# Altium schematic sheet BopITSCH.SchDoc
size A; SheetNumber: 1; SheetTotal: 1
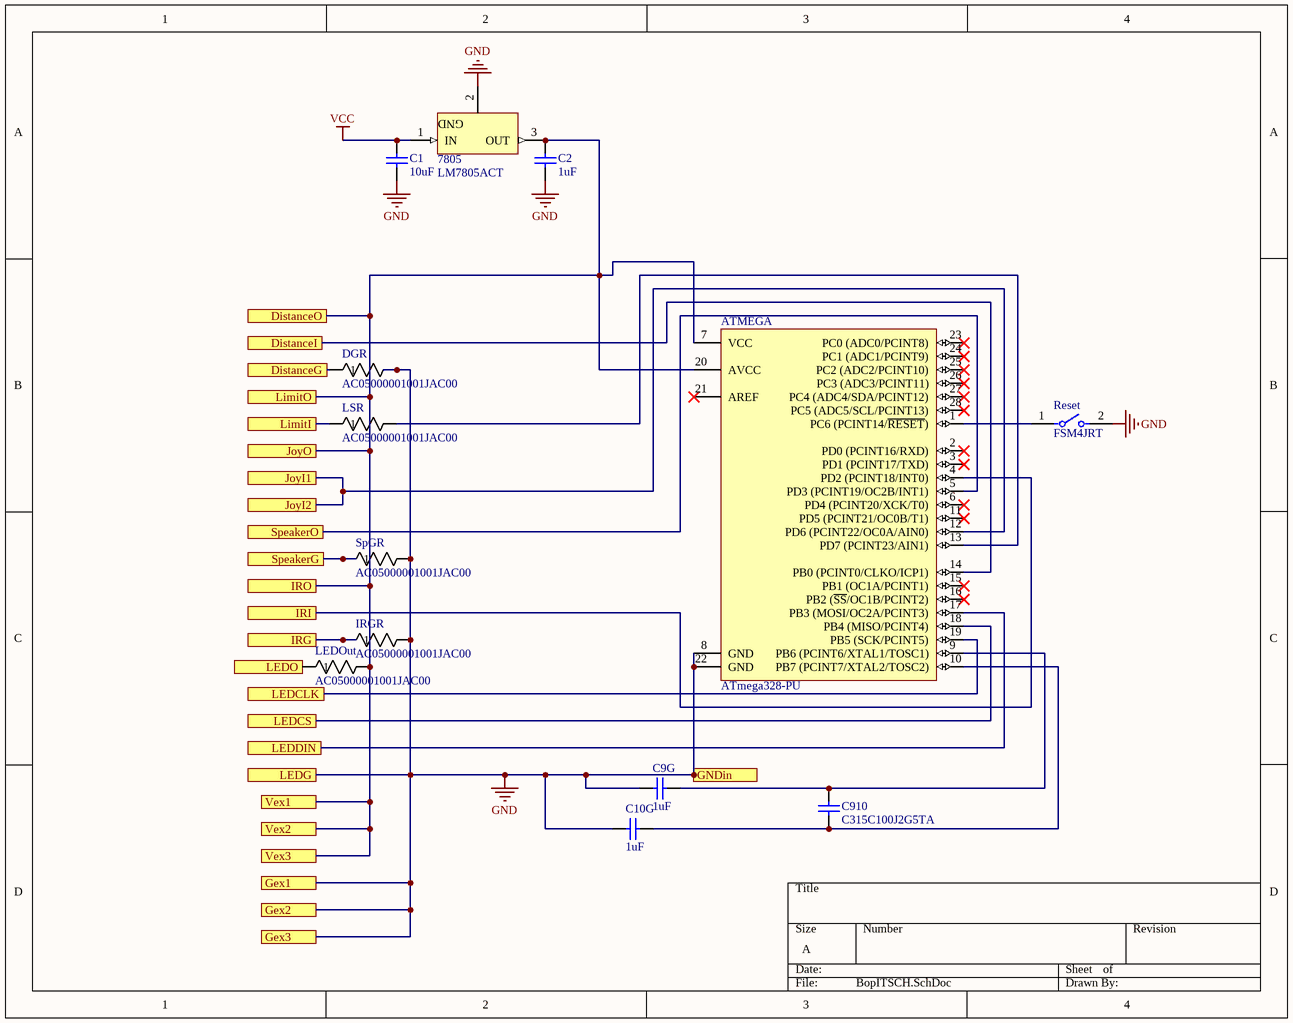
[diagram p0: BopITSCH.SchDoc]

## Parts
7805  LM7805ACT  [FAIR-TO-220-3]
ATMEGA  ATmega328-PU  [28P3]
C1  10uF  [KEMT-C315-THT-2]
C2  1uF  [KEMT-C315-THT-2]
C9G  1uF  [KEMT-C315-THT-2]
C10G  1uF  [KEMT-C315-THT-2]
C910  C315C100J2G5TA  [KEMT-C315-THT-2]
DGR  AC05000001001JAC00  [RES_AC05_VIS]
IRGR  AC05000001001JAC00  [RES_AC05_VIS]
LEDOut  AC05000001001JAC00  [RES_AC05_VIS]
LSR  AC05000001001JAC00  [RES_AC05_VIS]
Reset  FSM4JRT  [FP-FSM4JRT-MFG]
SpGR  AC05000001001JAC00  [RES_AC05_VIS]

## Ports
DistanceG, DistanceI, DistanceO, Gex1, Gex2, Gex3, GNDin, IRG, IRI, IRO, JoyI1, JoyI2, JoyO, LEDCLK, LEDCS, LEDDIN, LEDG, LEDO, LimitI, LimitO, SpeakerG, SpeakerO, Vex1, Vex2, Vex3

## Nets
GND: 7805.2(GND) ATMEGA.8(GND) ATMEGA.22(GND) C1.1 C2.1 C9G.2 C10G.2 DGR.2 IRGR.2 Reset.2 SpGR.2 ; port LEDG, port GNDin, port Gex1, port Gex2, port Gex3
VCC: 7805.1(IN) C1.2
DistanceG: DGR.1 ; port DistanceG
DistanceI: ATMEGA.14(PB0_(PCINT0/CLKO/ICP1)) ; port DistanceI
DistanceO: 7805.3(OUT) ATMEGA.7(VCC) ATMEGA.20(AVCC) C2.2 LEDOut.2 ; port DistanceO, port LimitO, port JoyO, port IRO, port Vex1, port Vex2, port Vex3
IRG: IRGR.1 ; port IRG
IRI: ATMEGA.4(PD2_(PCINT18/INT0)) ; port IRI
JoyI1: ATMEGA.12(PD6_(PCINT22/OC0A/AIN0)) ; port JoyI1, port JoyI2
LEDCLK: ATMEGA.19(PB5_(SCK/PCINT5)) ; port LEDCLK
LEDCS: ATMEGA.18(PB4_(MISO/PCINT4)) ; port LEDCS
LEDDIN: ATMEGA.17(PB3_(MOSI/OC2A/PCINT3)) ; port LEDDIN
LEDO: LEDOut.1 ; port LEDO
LimitI: LSR.1 ; port LimitI
SpeakerG: SpGR.1 ; port SpeakerG
SpeakerO: ATMEGA.5(PD3_(PCINT19/OC2B/INT1)) ; port SpeakerO
NetATMEGA_1: ATMEGA.1(PC6_(PCINT14/~{RESET})) Reset.1
NetATMEGA_9: ATMEGA.9(PB6_(PCINT6/XTAL1/TOSC1)) C9G.1 C910.2
NetATMEGA_10: ATMEGA.10(PB7_(PCINT7/XTAL2/TOSC2)) C10G.1 C910.1
NetATMEGA_13: ATMEGA.13(PD7_(PCINT23/AIN1)) LSR.2

Not connected (* = marked no-connect by the designer): ATMEGA 2(PD0_(PCINT16/RXD))* 3(PD1_(PCINT17/TXD))* 6(PD4_(PCINT20/XCK/T0))* 11(PD5_(PCINT21/OC0B/T1))* 15(PB1_(OC1A/PCINT1))* 16(PB2_(~{SS}/OC1B/PCINT2))* 21(AREF)* 23(PC0_(ADC0/PCINT8))* 24(PC1_(ADC1/PCINT9))* 25(PC2_(ADC2/PCINT10))* 26(PC3_(ADC3/PCINT11))* 27(PC4_(ADC4/SDA/PCINT12))* 28(PC5_(ADC5/SCL/PCINT13))*

## Library data of the parts
7805 = CMP-2000-04937-1: Positive Voltage Regulator, 5 V, 1 A, 0 to 125 degC, 3-Pin TO-220, RoHS, Tube; Manufacturer: Fairchild; Number of Outputs: 1; Typical Dropout Voltage @ Current: 2V@1A; Output Type: Fixed; Output Voltage: 5V; Quiescent Current: 6mA; Dropout Voltage Measurement Current: 1A; Line Regulation: 50mV; Maximum Input Voltage: 35V; Regulator Function: Linear; Load Regulation: 100mV; Package Type: TO-220; Mounting Type: ThroughHole; Height: 16.51mm; Maximum Operating Temperature: +125degC; Datasheet Version: Rev. 1.0.1, 05/2006; Package Reference: TO-220; Minimum Operating Temperature: 0degC; Manufacturer URL: https://www.fairchildsemi.com/; Package URL: https://www.fairchildsemi.com/package-drawings/TO/TO220B03.pdf; Length: 10.67mm; Series: LM78xx; Dimensions: 10.67x4.83x16.51mm; Polarity: Positive; Maximum Output Current: 1A; Pin Count: 3; Width: 4.83mm; Package Description: 3-Pin Through Hole Device, Body 10 x 4.5 mm, Pitch 2.54 mm; Datasheet URL: https://datasheet.ciiva.com/5816/1359194-5816420.pdf
ATMEGA = CMP-0095-00015-2: 8-bit AVR Microcontroller, 32KB Flash, 1KB EEPROM, 2KB SRAM, 28-pin PDIP, Industrial Grade (-40°C to 85°C); ComponentLink3Description: ATmega48A/48PA/88A/88PA/168A/168PA/328/328P Summary; RevisionNote: DatasheetVersion updated. URLs added.; DatasheetVersion: revD, May-2011; ComponentLink1URL: http://www.atmel.com/; PackageVersion: revB, Sep-2001; PackageDescription: 28-lead (0.300"/7.62mm Wide) Plastic Dual Inline Package (PDIP); PackageReference: 28P3; ComponentLink1Description: Manufacturer URL; ComponentLink2Description: ATmega48A/48PA/88A/88PA/168A/168PA/328/328P Datasheet; ComponentLink3URL: http://www.atmel.com/dyn/resources/prod_documents/8271S.pdf; ComponentLink2URL: http://www.atmel.com/dyn/resources/prod_documents/8271.pdf
C1 C2 C9G C10G C910 = CMP-1664-00009-1: Capacitor, Ceramic, 10 pF, +/-5 %, 200 V, 2-Pin THD, RoHS, Bulk; Case\Package: DIP; Nominal Gain Bandwith Product: 700 KHz; Nominal Supply Current: 1.2 mA; Min Supply Voltage: 1.5 V; Output Current: 30 mA; Max Supply Voltage: 16 V; Nominal Voltage Gain: 100 dB; Nominal Supply Voltage: 5 V; Slew Rate: 0.3 V\us; Channels: 2; Common Mode Rejection Ratio: 65 dB; Max Operating Temperature: 70 degC; Pins: 8; ComponentLink2Description: Datasheet; REACH SVHC: No SVHC; ComponentLink1Description: Manufacturer URL; Radiation Hardening: No; Packaging: Rail/Tube; ComponentLink1URL: http://www.kemet.com/; Unity Gain Bandwidth Product: 700 KHz; RoHSCompliant: true; Mount: Through Hole; Bandwidth: 700 KHz; Min Dual Supply Voltage: 1.5 V; PackageDescription: 2-Pin Through Hole Device, Body 3.81 x 2.54 mm; Max Dual Supply Voltage: 16 V; DatasheetVersion: Aug-16; Package Quantity: 50; Min Operating Temperature: 0 degC; PackageReference: C315-THT-2; ComponentLink2URL: http://capacitoredge.kemet.com/capedge2/DataSheet/Datasheet-C315C100J2G5TA.pdf?pn=C315C100J2G5TA{BULK}
DGR IRGR LEDOut LSR SpGR = CMP-00030-39746222-1: AC05000001001JAC00 Resistor, Wirewound, Res 1 Kilohms, Pwr-Rtg 5 W, Tol 5%, Axial, Ceramic Core; Temperature Coefficient: 180ppm/°C; Max Power Dissipation: 5W; Resistance: 1kΩ; Voltage Rating: 71V; Lead Diameter: 800µm; Termination: Axial; Width: 7.49mm; Tolerance: 5%; Features: Flame Retardant Coating; Lead Free: Lead Free; Radiation Hardening: No; Power Rating: 5W; Diameter: 7.5mm; Length: 18mm; Min Operating Temperature: 0°C; Max Operating Temperature: 275°C; Number of Pins: 2; Packaging: Tape & Box (TB); Contact Plating: Tin; Voltage Rating (DC): 71V; NexarPartId: 39746222; Military Standard: Not; Composition: Wirewound; Case/Package: Conformal; RoHS: Compliant; Schedule B: 8533210080, 8533210080; Mount: Through Hole; Number of Terminations: 2; REACH SVHC: Unknown
Reset = CMP-03407-000038-1: SWITCH TACTILE SPST-NO 0.05A 24V; Current Rating: 50mA; Actuator Diameter: 3.5mm; Max Voltage Rating (DC): 12V; Actuator Length: 0.055inch; Switch Travel: 0.25mm; Actuator Type: Standard; Contact Resistance: 100mR; Illumination Type: Non-Illuminated; Electrical Life: 100000Cycles; Throw Configuration: SPST; Switch Function: Off-Mom; Actuator Material: Resin; Operating Force: 1.57N; Series: FSMJRT; Min Operating Temperature: -35°C; Max Current Rating: 50mA; Termination: PC Pins; Type: Switch; Radiation Hardening: No; Max Operating Temperature: 105°C; Voltage Rating (DC): 12V; Contact Material: Copper Alloy; Contact Current Rating: 50mA; RoHS Compliant: Yes; Mechanical Life: 100000Cycles; Mount: Through Hole; Package Quantity: 10000; Case/Package: Radial; Packaging: Tape and Reel; Length: 6.19mm; Contact Plating: Silver; Depth: 6.19mm; Orientation: Straight